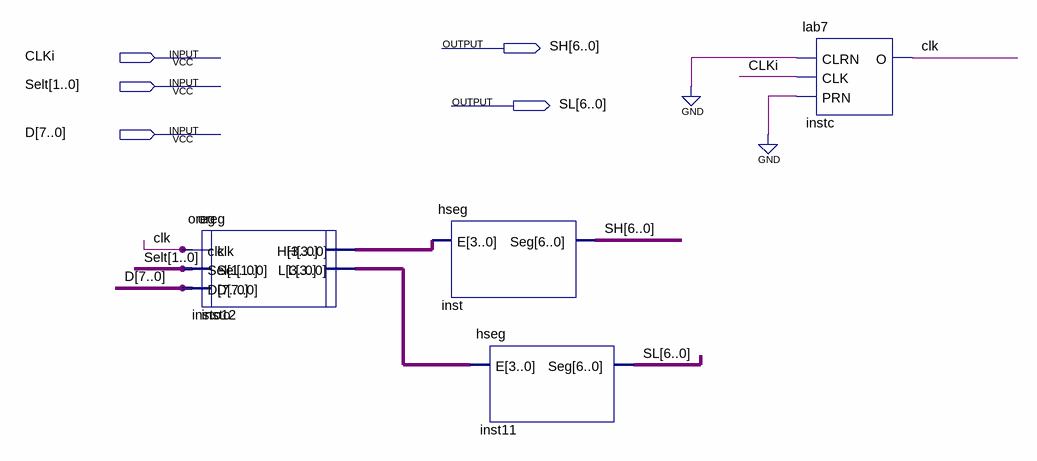
[diagram p0: schematic sheet]
// Quartus schematic Lab08.bdf as structural Verilog: 5 symbols, 5 pins
module Lab08 (
  input  CLKi,
  input  [1:0] Selt,
  input  [7:0] D,
  output [6:0] SH,
  output [6:0] SL
);

  wire clk;
  wire [3:0] insto_h, insto_l;

  oreg insto (.clk(clk), .Sel(Selt), .D(D), .H(insto_h), .L(insto_l));
  oreg insto12 (.clk(clk), .Sel(Selt), .D(D));  // open: H, L
  hseg inst (.E(insto_h), .Seg(SH));
  hseg inst11 (.E(insto_l), .Seg(SL));
  lab7 instc (.CLRN(1'b0), .CLK(CLKi), .PRN(1'b0), .O(clk));
endmodule
